# Altium project LoRaBoard.PrjPcb
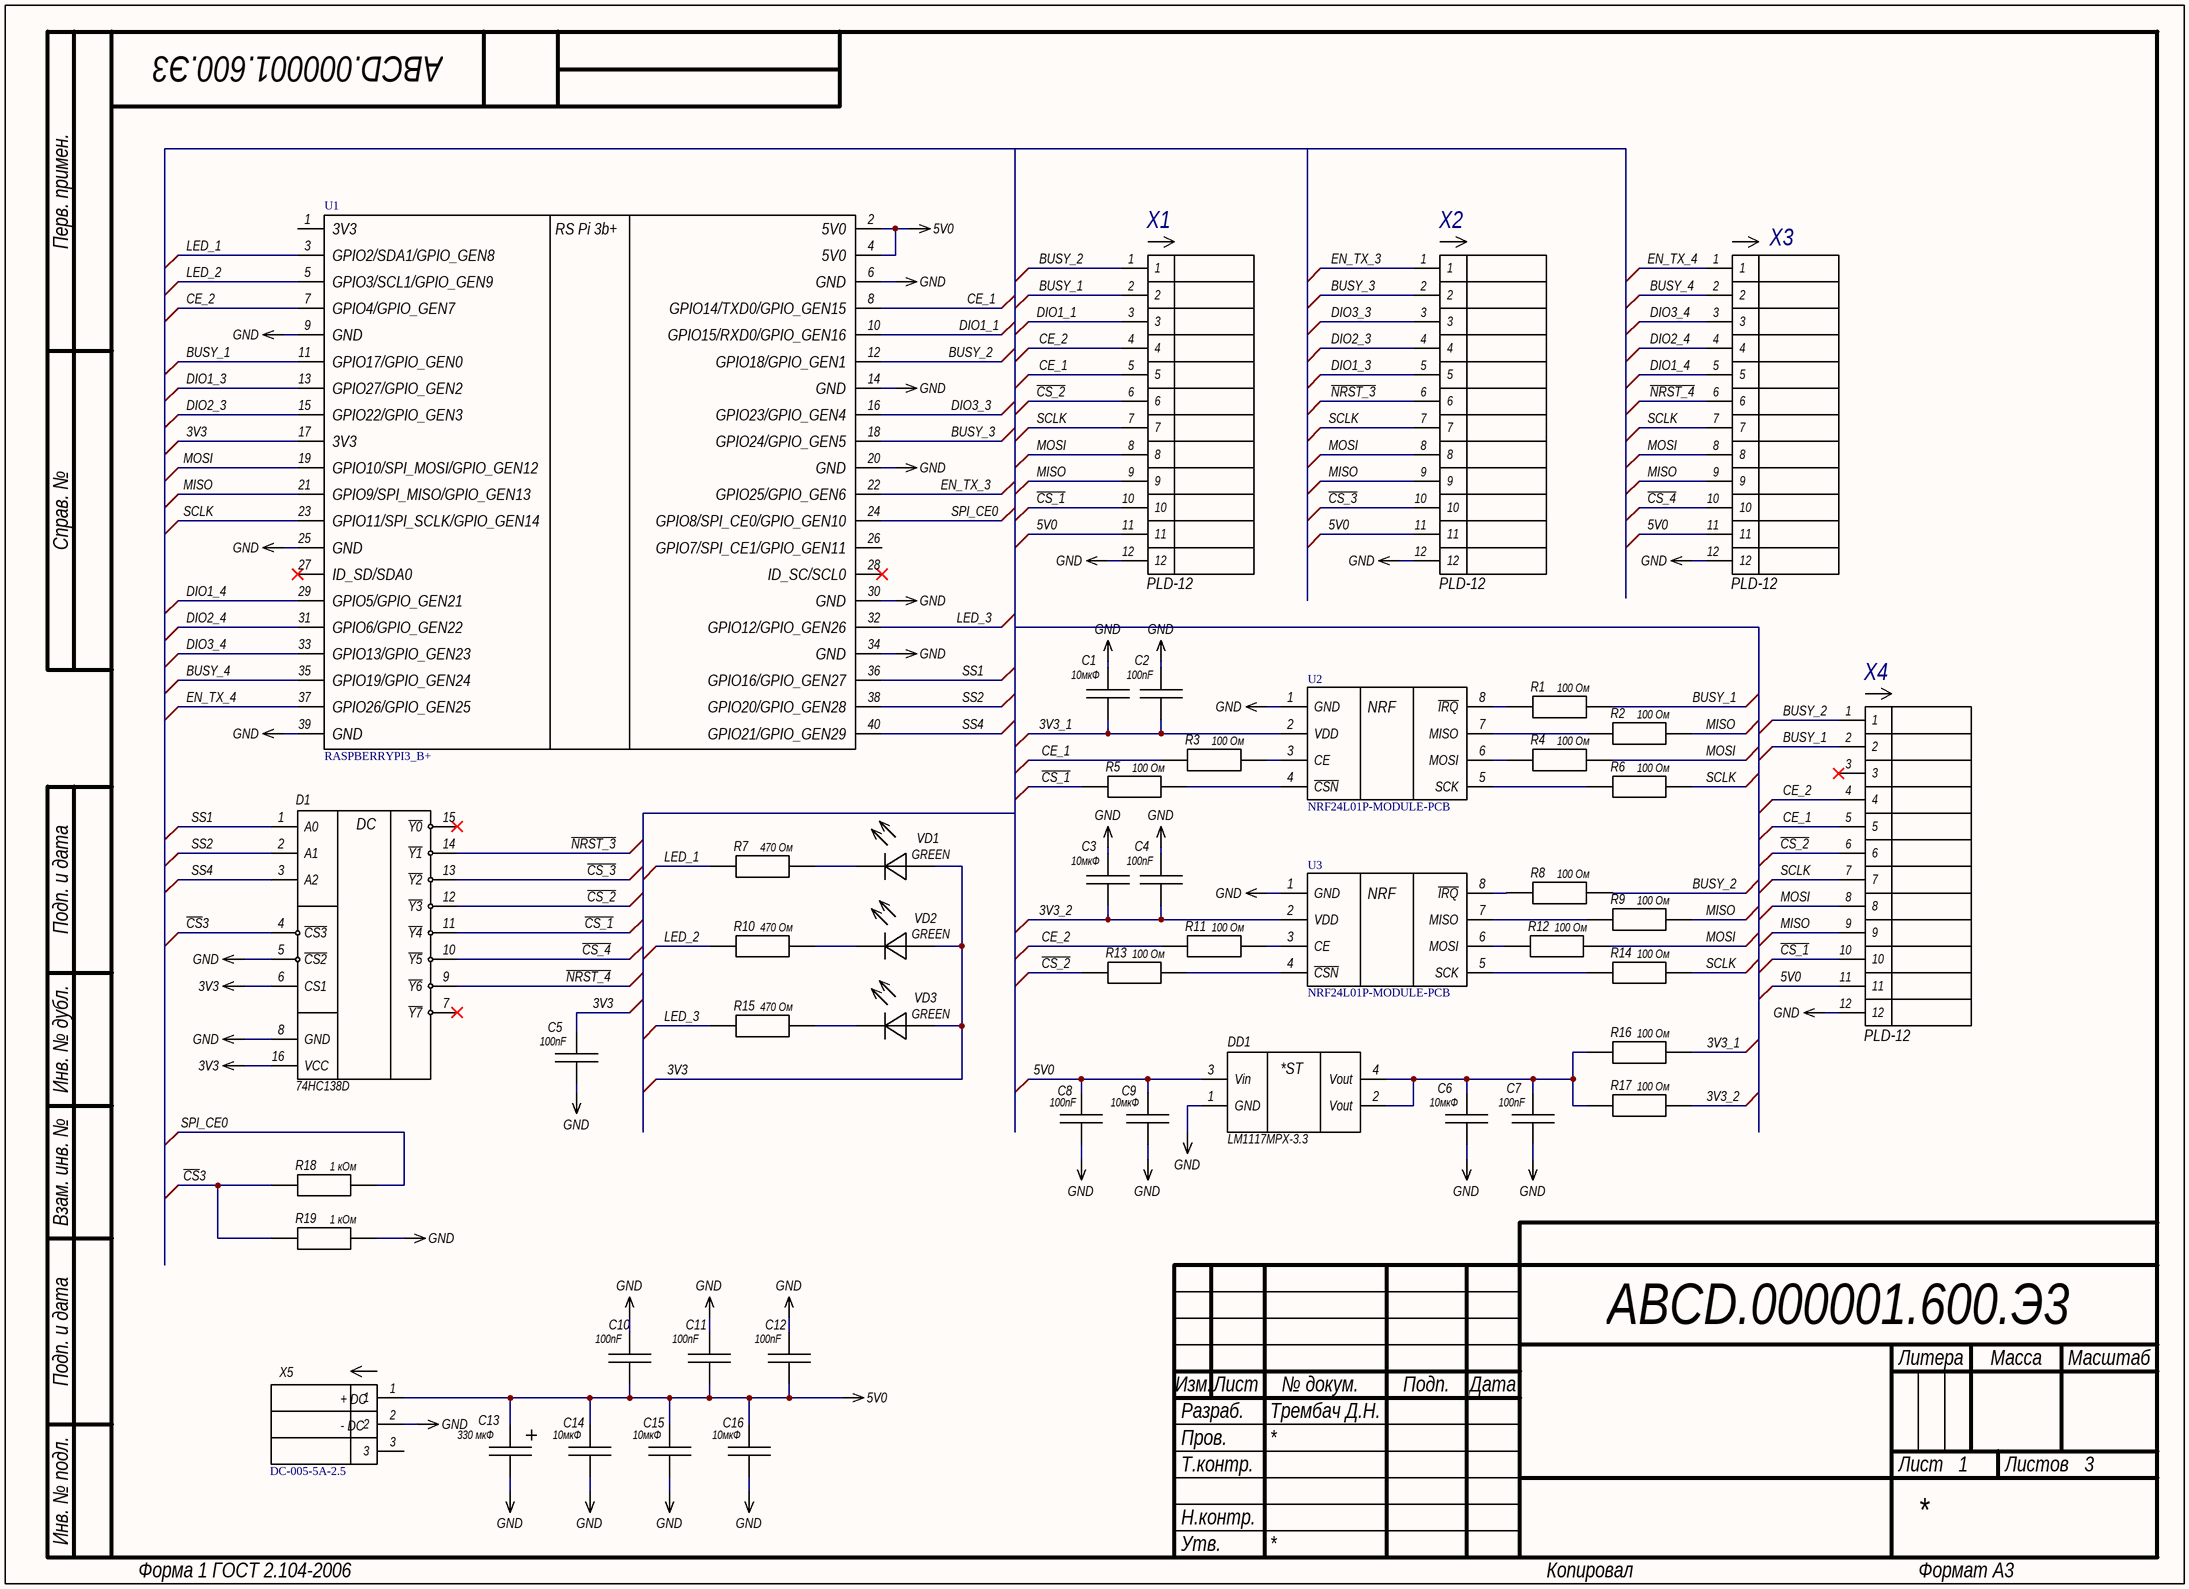
[diagram p0: LoRaBoard_1.SchDoc]
3 sheets, 150 parts. Net scope: global (net labels, ports and power ports of the same name join across sheets).
Board file: LoRaBoard.PcbDoc
Sheets:
  LoRaBoard_1.SchDoc
  LoRaBoard_2.SchDoc
  LoRaBoard_3.SchDoc

## Sheet LoRaBoard_1.SchDoc
size 410 x 297 mm; Author: Трембач Д.Н.; DocumentNumber: ABCD.000001.600.Э3; SheetNumber: 1; SheetTotal: 3

### Parts
C1  10мкФ  [CAP 0805]
C2  100nF  [CAP 0603_1608 RF]
C3  10мкФ  [CAP 0805]
C4  100nF  [CAP 0603_1608 RF]
C5  100nF  [CAP 0603_1608 RF]
C6  10мкФ  [CAP 0805]
C7  100nF  [CAP 0603_1608 RF]
C8  100nF  [CAP 0603_1608 RF]
C9  10мкФ  [CAP 0805]
C10  100nF  [CAP 0603_1608 RF]
C11  100nF  [CAP 0603_1608 RF]
C12  100nF  [CAP 0603_1608 RF]
C13  330 мкФ  [CAP ALSMD ELEC 10.5x10.0 mm]
C14  10мкФ  [CAP 0805]
C15  10мкФ  [CAP 0805]
C16  10мкФ  [CAP 0805]
D1  74HC138D  [SO-16]
DD1  LM1117MPX-3.3  [SOT223]
R1  100 Ом  [RES 0603_1608]
R2  100 Ом  [RES 0603_1608]
R3  100 Ом  [RES 0603_1608]
R4  100 Ом  [RES 0603_1608]
R5  100 Ом  [RES 0603_1608]
R6  100 Ом  [RES 0603_1608]
R7  470 Ом  [RES 0603_1608]
R8  100 Ом  [RES 0603_1608]
R9  100 Ом  [RES 0603_1608]
R10  470 Ом  [RES 0603_1608]
R11  100 Ом  [RES 0603_1608]
R12  100 Ом  [RES 0603_1608]
R13  100 Ом  [RES 0603_1608]
R14  100 Ом  [RES 0603_1608]
R15  470 Ом  [RES 0603_1608]
R16  100 Ом  [RES 0603_1608]
R17  100 Ом  [RES 0603_1608]
R18  1 кОм  [RES 0603_1608]
R19  1 кОм  [RES 0603_1608]
U1  RASPBERRYPI3_B+  [MODULE_RASPBERRYPI3_B+]
U2  NRF24L01P-MODULE-PCB  [NRF24L01P-MODULE]
U3  NRF24L01P-MODULE-PCB  [NRF24L01P-MODULE]
VD1  value GREEN  [LED 0603_1608 GREEN]  (hidden comment: LED SMD GREEN)
VD2  value GREEN  [LED 0603_1608 GREEN]  (hidden comment: LED SMD GREEN)
VD3  value GREEN  [LED 0603_1608 GREEN]  (hidden comment: LED SMD GREEN)
X1  value PLD-12  [PLD_12_elipse]  (hidden comment: PLD-12 (DS1021-2x6))
X2  value PLD-12  [PLD_12_elipse]  (hidden comment: PLD-12 (DS1021-2x6))
X3  value PLD-12  [PLD_12_elipse]  (hidden comment: PLD-12 (DS1021-2x6))
X4  value PLD-12  [PLD_12_elipse]  (hidden comment: PLD-12 (DS1021-2x6))
X5  DC-005-5A-2.5  [DC-005-5A-2.5]

### Nets
3V3: C5.2 D1.6(CS1) D1.16(VCC) U1.17 VD1.1(А) VD2.1(А) VD3.1(А)
5V0: C8.2 C9.2 C10.2 C11.2 C12.2 C13.1 C14.2 C15.2 C16.2 DD1.3(Vin) U1.2 U1.4 X1.11 X2.11 X3.11 X4.11 X5.1
GND: C1.1 C2.1 C3.1 C4.1 C5.1 C6.1 C7.1 C8.1 C9.1 C10.1 C11.1 C12.1 C13.2 C14.1 C15.1 C16.1 D1.5(~{CS2}) D1.8(GND) DD1.1(GND) R19.2 U1.6 U1.9 U1.14 U1.20 U1.25 U1.30 U1.34 U1.39 U2.1(GND) U3.1(GND) X1.12 X2.12 X3.12 X4.12 X5.2
3V3_1: C1.2 C2.2 R16.2 U2.2(VDD)
3V3_2: C3.2 C4.2 R17.2 U3.2(VDD)
~{CS}3: D1.4(~{CS3}) R18.1 R19.1
BUSY_1: R1.2 U1.11 X1.2 X4.2
BUSY_2: R8.2 U1.12 X1.1 X4.1
BUSY_3: U1.18 X2.2
BUSY_4: U1.35 X3.2
~{CS_1}: D1.11(~{Y4}) R5.1 X1.10 X4.10
~{CS_2}: D1.12(~{Y3}) R13.1 X1.6 X4.6
~{CS_3}: D1.13(~{Y2}) X2.10
~{CS_4}: D1.10(~{Y5}) X3.10
CE_1: R3.1 U1.8 X1.5 X4.5
CE_2: R11.1 U1.7 X1.4 X4.4
DIO1_1: U1.10 X1.3
DIO1_3: U1.13 X2.5
DIO1_4: U1.29 X3.5
DIO2_3: U1.15 X2.4
DIO2_4: U1.31 X3.4
DIO3_3: U1.16 X2.3
DIO3_4: U1.33 X3.3
EN_TX_3: U1.22 X2.1
EN_TX_4: U1.37 X3.1
LED_1: R7.1 U1.3
LED_2: R10.1 U1.5
LED_3: R15.1 U1.32
MISO: R2.2 R9.2 U1.21 X1.9 X2.9 X3.9 X4.9
MOSI: R4.2 R12.2 U1.19 X1.8 X2.8 X3.8 X4.8
~{NRST_3}: D1.14(~{Y1}) X2.6
~{NRST_4}: D1.9(~{Y6}) X3.6
SCLK: R6.2 R14.2 U1.23 X1.7 X2.7 X3.7 X4.7
SPI_CE0: R18.2 U1.24
SS1: D1.1(A0) U1.36
SS2: D1.2(A1) U1.38
SS4: D1.3(A2) U1.40
NetC6_2: C6.2 C7.2 DD1.2(Vout) DD1.4(Vout) R16.1 R17.1
NetR1_1: R1.1 U2.8(~{IRQ})
NetR2_1: R2.1 U2.7(MISO)
NetR3_2: R3.2 U2.3(CE)
NetR4_1: R4.1 U2.6(MOSI)
NetR5_2: R5.2 U2.4(~{CSN})
NetR6_1: R6.1 U2.5(SCK)
NetR7_2: R7.2 VD1.2(К)
NetR8_1: R8.1 U3.8(~{IRQ})
NetR9_1: R9.1 U3.7(MISO)
NetR10_2: R10.2 VD2.2(К)
NetR11_2: R11.2 U3.3(CE)
NetR12_1: R12.1 U3.6(MOSI)
NetR13_2: R13.2 U3.4(~{CSN})
NetR14_1: R14.1 U3.5(SCK)
NetR15_2: R15.2 VD3.2(К)

Not connected (* = marked no-connect by the designer): D1 7(~{Y7})* 15(~{Y0})*; U1 1 26 27* 28*; X4 3*; X5 3

### Notes on the sheet
- Перв. примен.
- Справ. №
- Подп. и дата
- Инв. № дубл.
- Взам. инв. №
- Разраб.
- Изм.
- Лист
- № докум.
- Подп.
- Дата
- Литера
- Масса
- Масштаб
- Пров.
- Т.контр.
- Листов
- Инв. № подл.
- Н.контр.
- Утв.
- Форма 1 ГОСТ 2.104-2006
- Копировал
- Формат А3
- (in symbol 74HC138D) DC
- (in symbol DC-005-5A-2.5) + DC; - DC
- (in symbol LM1117MPX-3.3) *ST
- (in symbol NRF24L01P-MODULE-PCB) NRF
- (in symbol RASPBERRYPI3_B+) 3V3; RS Pi 3b+; 5V0; GPIO2/SDA1/GPIO_GEN8; GPIO3/SCL1/GPIO_GEN9; GND; GPIO4/GPIO_GEN7; GPIO14/TXD0/GPIO_GEN15; GPIO15/RXD0/GPIO_GEN16; GPIO17/GPIO_GEN0; GPIO18/GPIO_GEN1; GPIO27/GPIO_GEN2; GPIO22/GPIO_GEN3; GPIO23/GPIO_GEN4; GPIO24/GPIO_GEN5; GPIO10/SPI_MOSI/GPIO_GEN12; GPIO9/SPI_MISO/GPIO_GEN13; GPIO25/GPIO_GEN6; GPIO11/SPI_SCLK/GPIO_GEN14; GPIO8/SPI_CE0/GPIO_GEN10; GPIO7/SPI_CE1/GPIO_GEN11; ID_SD/SDA0; ID_SC/SCL0; GPIO5/GPIO_GEN21; GPIO6/GPIO_GEN22; GPIO12/GPIO_GEN26; GPIO13/GPIO_GEN23; GPIO19/GPIO_GEN24; GPIO16/GPIO_GEN27; GPIO26/GPIO_GEN25; GPIO20/GPIO_GEN28; GPIO21/GPIO_GEN29

### Library data of the parts
C1 C3 C6 C9 C14-C16 = Capacitor: 10мкФ X5R 16В 10% 0805, CC0805KKX5R7BB106; Vendor Code: *; Value: 10мкФ; Part Number: CC0805KKX5R7BB106
C2 C4 C5 C7 C8 C10-C12 = Capacitor: CC0603JPX7R9BB104, 50V 100nF X7R 5% 0603; Vendor Code: *; Value: 100nF; Part Number: CC0603JPX7R9BB104
C13 = CAP ALSMD ELEC: ECAP SMD, 330 мкФ, 35 В, 105°C, 20% 10x10.5мм, JCK1V331M100105; Vendor Code: *; Value: 330 мкФ; Part Number: ECAP SMD, 330 мкФ, 35 В, 105°C, 20% 10x10.5мм, JCK1V331M100105
D1 = 74HC138D: 3-to-8 line decoder/demultiplexer; Vendor Code: *; Value: 74HC138D
DD1 = LM1117MPX-3.3: 800mA Low-Dropout Linear Regulator; Vendor Code: *; Value: LM1117MPX-3.3
R1-R6 R8 R9 R11-R14 R16 R17 = Resistor: 0.1Вт 0603 100 Ом, 5%, RC0603JR-07100RL; Type: Резистор; Vendor Code: *; Value: 100 Ом; Part Number: RC0603JR-07100RL
R7 R10 R15 = Resistor: 0.1Вт 0603 100 Ом, 5%, RC0603JR-07470RL; Type: Резистор; Vendor Code: *; Value: 470 Ом; Part Number: RC0603JR-07470RL
R18 R19 = Resistor: 0.1Вт 0603 1 кОм, 5%, RC0603JR-071KL; Type: Резистор; Vendor Code: *; Value: 1 кОм; Part Number: RC0603JR-071KL
U1 = RASPBERRYPI3_B+: 1.4GHz 64-bit quad-core processor, dual-band wireless LAN, Bluetooth 4.2/BLE, faster Ethernet, and Power-over-Ethernet support (with separate PoE HAT); MF: Raspberry Pi Foundation (NF); Price: None; Availability: Unavailable; Package: None; SnapEDA_Link: https://www.snapeda.com/parts/RASPBERRYPI4%204GB/Raspberry%20Pi/view-part/3832294/?ref=snap; Value: *; MP: RASPBERRYPI3_B+; Vendor Code: *
U2 U3 = NRF24L01P-MODULE-PCB: - Transceiver For Use With nRF24L01+; MF: Nordic Semiconductor; Package: None; MP: NRF24L01P-MODULE-PCB; Value: *; Availability: Bad; Price: None; SnapEDA_Link: https://www.snapeda.com/parts/NRF24L01P-MODULE-PCB/Nordic%20Semiconductor%20ASA/view-part/230534/?ref=snap; Mouser-Purchase-URL: https://snapeda.com/shop?store=Mouser&id=230534
X1-X4 = PLD-12: 2.54mm PIN Header 2X6P Straight Type H=2.5mm Full Gold Flash Plating.; Published: 07.03.2013; Publisher: Andrew Danich; Type: Вилка
X5 = DC-005-5A-2.5: DC Power Receptacle Jack, Through Hole, Right Angle; MP: DC-005-5A-2.5
VD1-VD3 = LED SMD GREEN: Vendor Code: *

## Sheet LoRaBoard_2.SchDoc
size 410 x 297 mm; DocumentNumber: ABCD.000001.600.Э3; SheetNumber: 2; SheetTotal: 3; _DecimalNumber: ABCD.000001.600.Э3; _Sheet: 2; PageSetup: Record=PageOptions|CenterHorizontal=False|CenterVertical=False|PrintScale=1.00|XCorrection=1.00|YCorrection=1.00|PrintKind=0|BorderSize=5000000|LeftOffset=0|BottomOffset=0|Orientation=2|PaperLength=1000|PaperWidth=1000|Scale=100|PaperSource=7|PrintQuality=-3|MediaType=1|DitherType=10|PrintScaleMode=0|PaperKind=A3|PaperIndex=8
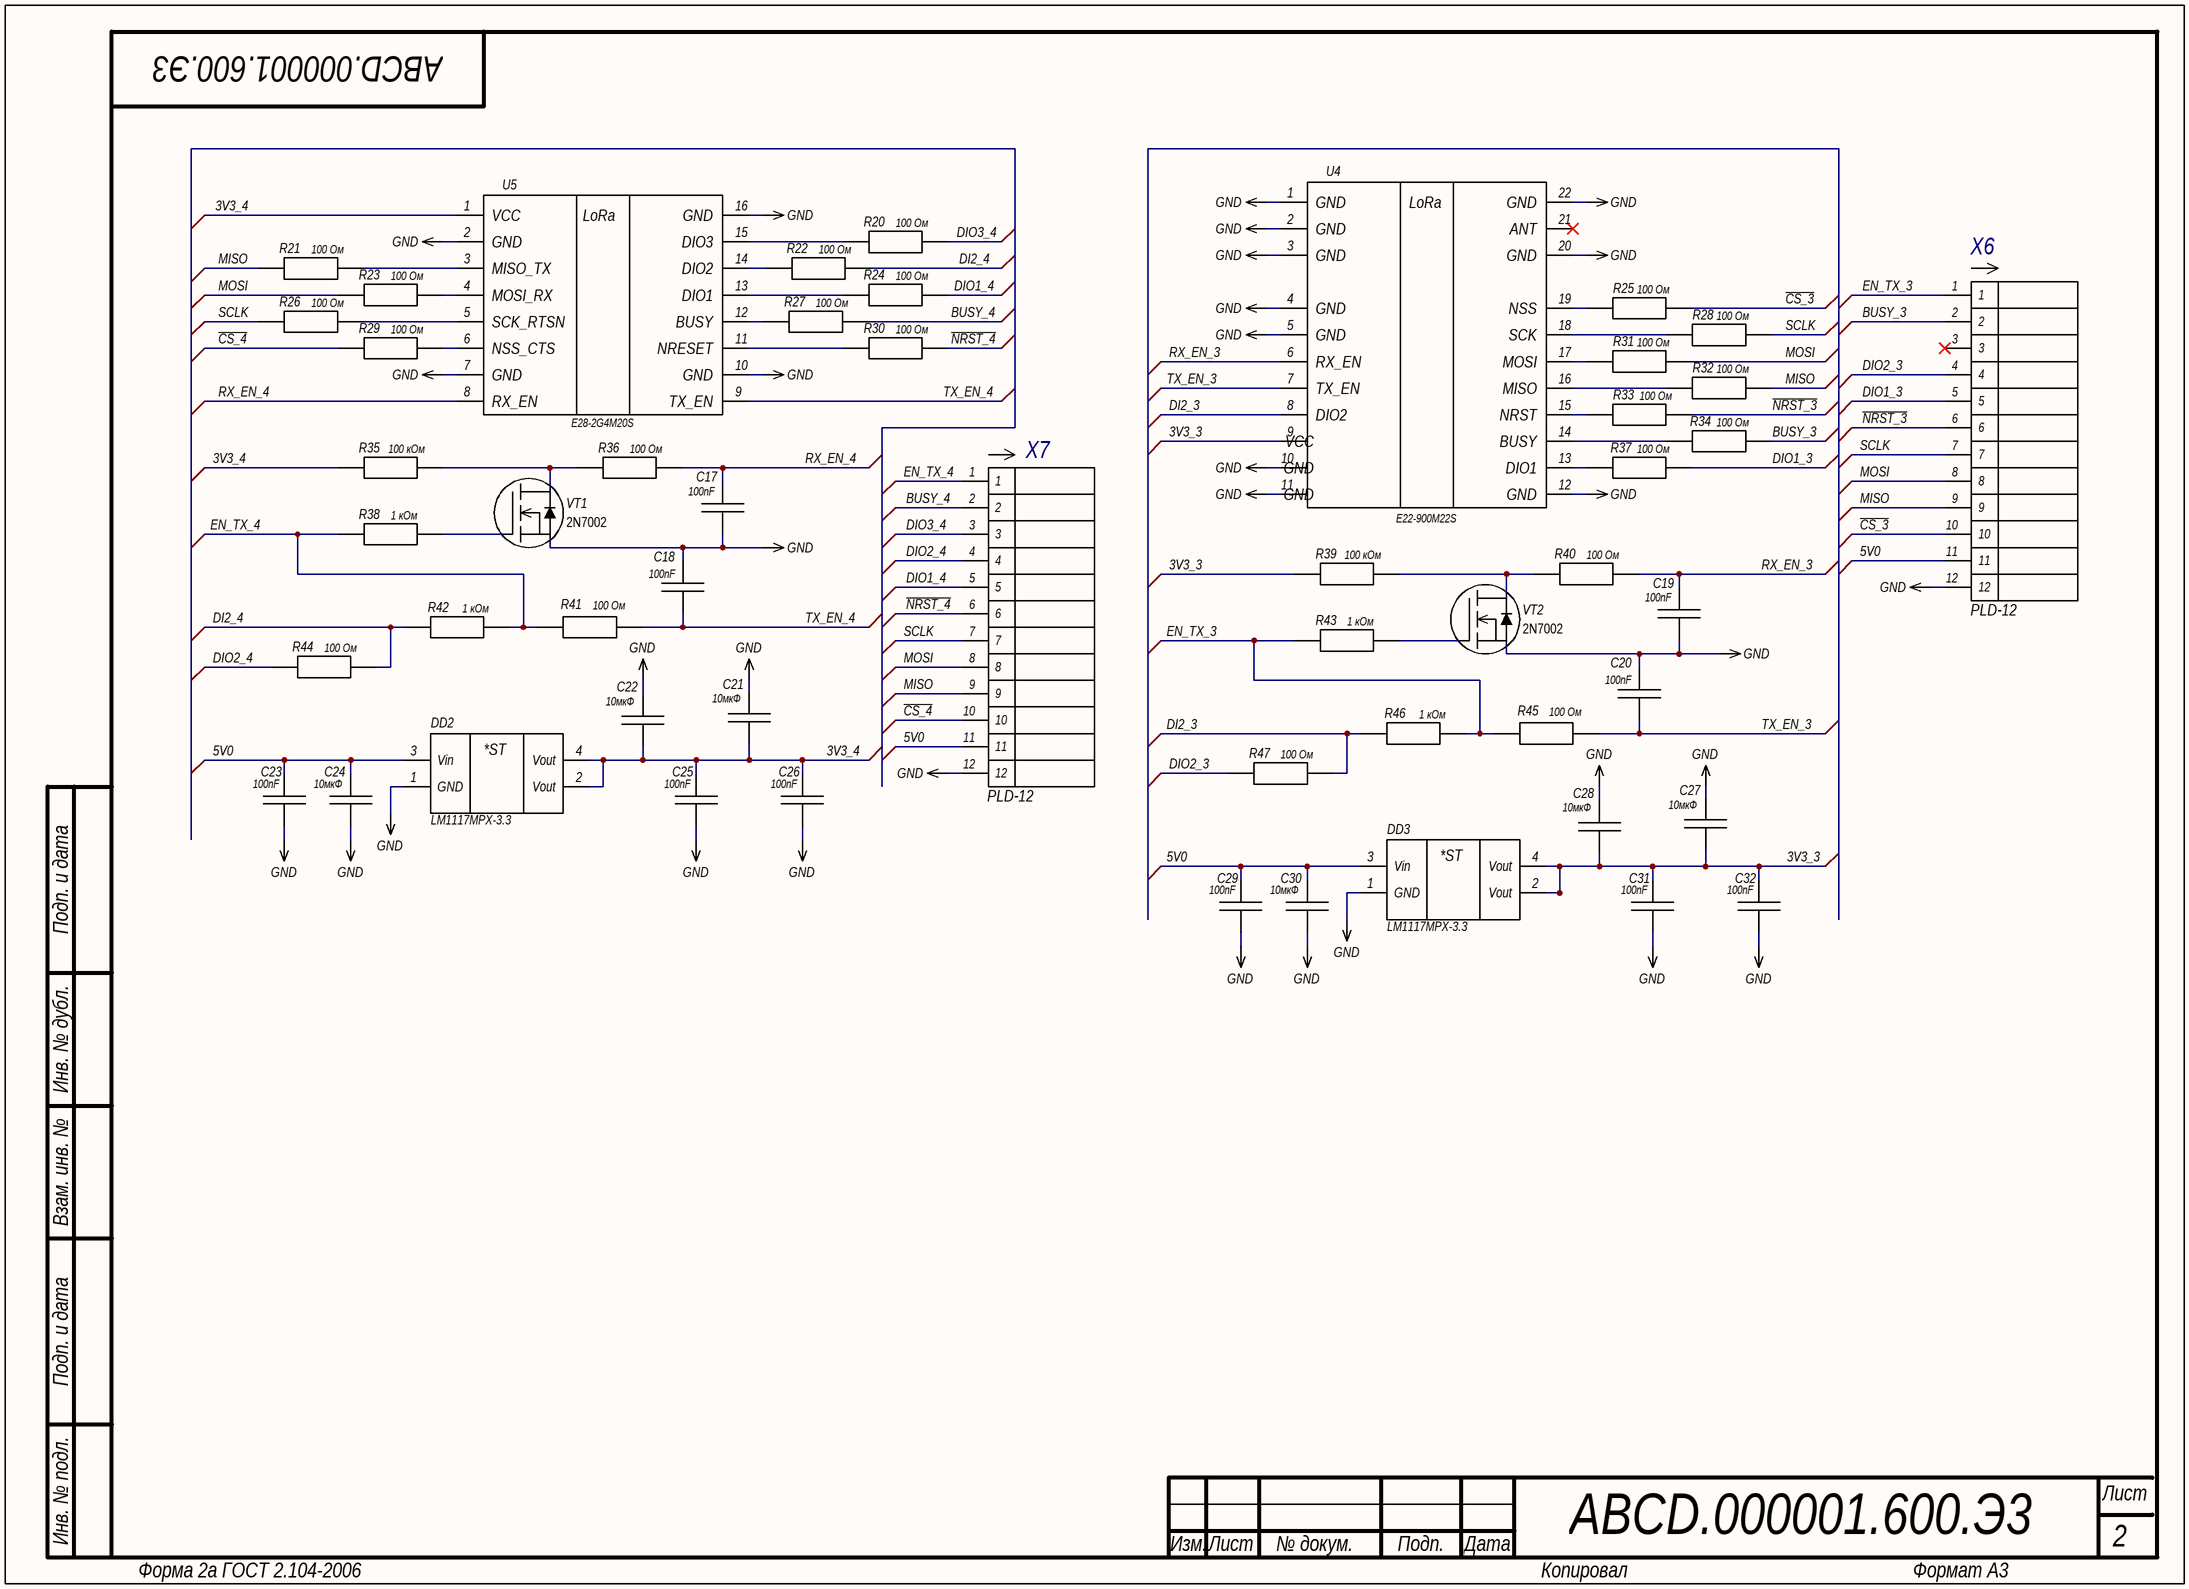
[diagram p1: LoRaBoard_2.SchDoc]

### Parts
C17  100nF  [CAP 0603_1608 RF]
C18  100nF  [CAP 0603_1608 RF]
C19  100nF  [CAP 0603_1608 RF]
C20  100nF  [CAP 0603_1608 RF]
C21  10мкФ  [CAP 0805]
C22  10мкФ  [CAP 0805]
C23  100nF  [CAP 0603_1608 RF]
C24  10мкФ  [CAP 0805]
C25  100nF  [CAP 0603_1608 RF]
C26  100nF  [CAP 0603_1608 RF]
C27  10мкФ  [CAP 0805]
C28  10мкФ  [CAP 0805]
C29  100nF  [CAP 0603_1608 RF]
C30  10мкФ  [CAP 0805]
C31  100nF  [CAP 0603_1608 RF]
C32  100nF  [CAP 0603_1608 RF]
DD2  LM1117MPX-3.3  [SOT223]
DD3  LM1117MPX-3.3  [SOT223]
R20  100 Ом  [RES 0603_1608]
R21  100 Ом  [RES 0603_1608]
R22  100 Ом  [RES 0603_1608]
R23  100 Ом  [RES 0603_1608]
R24  100 Ом  [RES 0603_1608]
R25  100 Ом  [RES 0603_1608]
R26  100 Ом  [RES 0603_1608]
R27  100 Ом  [RES 0603_1608]
R28  100 Ом  [RES 0603_1608]
R29  100 Ом  [RES 0603_1608]
R30  100 Ом  [RES 0603_1608]
R31  100 Ом  [RES 0603_1608]
R32  100 Ом  [RES 0603_1608]
R33  100 Ом  [RES 0603_1608]
R34  100 Ом  [RES 0603_1608]
R35  100 кОм  [RES 0603_1608]
R36  100 Ом  [RES 0603_1608]
R37  100 Ом  [RES 0603_1608]
R38  1 кОм  [RES 0603_1608]
R39  100 кОм  [RES 0603_1608]
R40  100 Ом  [RES 0603_1608]
R41  100 Ом  [RES 0603_1608]
R42  1 кОм  [RES 0603_1608]
R43  1 кОм  [RES 0603_1608]
R44  100 Ом  [RES 0603_1608]
R45  100 Ом  [RES 0603_1608]
R46  1 кОм  [RES 0603_1608]
R47  100 Ом  [RES 0603_1608]
U4  E22-900M22S  [E22 900M22S]
U5  E28-2G4M20S  [E28 2G4M20S]
VT1  2N7002  [SOT23-3]
VT2  2N7002  [SOT23-3]
X6  value PLD-12  [PLD_12_elipse]  (hidden comment: PLD-12 (DS1021-2x6))
X7  value PLD-12  [PLD_12_elipse]  (hidden comment: PLD-12 (DS1021-2x6))

### Nets
5V0: C23.2 C24.2 C29.2 C30.2 DD2.3(Vin) DD3.3(Vin) X6.11 X7.11
GND: C17.1 C18.2 C19.1 C20.2 C21.1 C22.1 C23.1 C24.1 C25.1 C26.1 C27.1 C28.1 C29.1 C30.1 C31.1 C32.1 DD2.1(GND) DD3.1(GND) U4.1 U4.2 U4.3 U4.4 U4.5 U4.10 U4.11 U4.12 U4.20 U4.22 U5.2 U5.7 U5.10 U5.16 VT1.2(S) VT2.2(S) X6.12 X7.12
3V3_3: C27.2 C28.2 C31.2 C32.2 DD3.2(Vout) DD3.4(Vout) R39.1 U4.9
3V3_4: C21.2 C22.2 C25.2 C26.2 DD2.2(Vout) DD2.4(Vout) R35.1 U5.1
BUSY_3: R34.2 X6.2
BUSY_4: R27.2 X7.2
~{CS_3}: R25.2 X6.10
~{CS_4}: R29.1 X7.10
DI2_3: R46.1 R47.2 U4.8
DI2_4: R22.2 R42.1 R44.2
DIO1_3: R37.2 X6.5
DIO1_4: R24.2 X7.5
DIO2_3: R47.1 X6.4
DIO2_4: R44.1 X7.4
DIO3_4: R20.2 X7.3
EN_TX_3: R43.1 R45.1 R46.2 X6.1
EN_TX_4: R38.1 R41.1 R42.2 X7.1
MISO: R21.1 R32.2 X6.9 X7.9
MOSI: R23.1 R31.2 X6.8 X7.8
~{NRST_3}: R33.2 X6.6
~{NRST_4}: R30.2 X7.6
RX_EN_3: C19.2 R40.2 U4.6
RX_EN_4: C17.2 R36.2 U5.8
SCLK: R26.1 R28.2 X6.7 X7.7
TX_EN_3: C20.1 R45.2 U4.7
TX_EN_4: C18.1 R41.2 U5.9
NetR20_1: R20.1 U5.15
NetR21_2: R21.2 U5.3
NetR22_1: R22.1 U5.14
NetR23_2: R23.2 U5.4
NetR24_1: R24.1 U5.13
NetR25_1: R25.1 U4.19
NetR26_2: R26.2 U5.5
NetR27_1: R27.1 U5.12
NetR28_1: R28.1 U4.18
NetR29_2: R29.2 U5.6
NetR30_1: R30.1 U5.11
NetR31_1: R31.1 U4.17
NetR32_1: R32.1 U4.16
NetR33_1: R33.1 U4.15
NetR34_1: R34.1 U4.14
NetR35_2: R35.2 R36.1 VT1.3(D)
NetR37_1: R37.1 U4.13
NetR38_2: R38.2 VT1.1(G)
NetR39_2: R39.2 R40.1 VT2.3(D)
NetR43_2: R43.2 VT2.1(G)

Not connected (* = marked no-connect by the designer): U4 21*; X6 3*

### Notes on the sheet
- Подп. и дата
- Инв. № дубл.
- Взам. инв. №
- Инв. № подл.
- Изм.
- Лист
- № докум.
- Подп.
- Дата
- Форма 2а ГОСТ 2.104-2006
- Копировал
- Формат А3
- (in symbol E22-900M22S) GND; LoRa; ANT; NSS; SCK; RX_EN; MOSI; TX_EN; MISO; DIO2; NRST; VCC; BUSY; DIO1
- (in symbol E28-2G4M20S) VCC; LoRa; GND; DIO3; MISO_TX; DIO2; MOSI_RX; DIO1; SCK_RTSN; BUSY; NSS_CTS; NRESET; RX_EN; TX_EN
- (in symbol LM1117MPX-3.3) *ST

### Library data of the parts
C17-C20 C23 C25 C26 C29 C31 C32 = Capacitor: CC0603JPX7R9BB104, 50V 100nF X7R 5% 0603; Vendor Code: *; Value: 100nF; Part Number: CC0603JPX7R9BB104
C21 C22 C24 C27 C28 C30 = Capacitor: as C1 on sheet LoRaBoard_1; Vendor Code: *; Value: 10мкФ; Part Number: CC0805KKX5R7BB106
DD2 DD3 = LM1117MPX-3.3: 800mA Low-Dropout Linear Regulator; Vendor Code: *; Value: LM1117MPX-3.3
R20-R34 R36 R37 R40 R41 R44 R45 R47 = Resistor: 0.1Вт 0603 100 Ом, 5%, RC0603JR-07100RL; Type: Резистор; Vendor Code: *; Value: 100 Ом; Part Number: RC0603JR-07100RL
R35 R39 = Resistor: 0.1Вт 0603 100 кОм, 5%, RC0603JR-071KL; Part Number: RC0603JR-07100KL; Type: Резистор; Vendor Code: *; Value: 100 кОм
R38 R42 R43 R46 = Resistor: 0.1Вт 0603 1 кОм, 5%, RC0603JR-071KL; Type: Резистор; Vendor Code: *; Value: 1 кОм; Part Number: RC0603JR-071KL
U4 = E22-900M22S: E22-900M22S Ebyte -147dBm 22.3dBm 7km SPI SMD,14x20mm LoRa Modules; Pitch: 1.27; Part Number: E22-900M22S; Value: E22-900M22S; Package: 14x20mm; Temperature Range: -40…+85 °C; Manufacturer: EBYTE; Number of Rows: 2; Number of Pins: 22
U5 = E28-2G4M20S: E28-2G4M20S Ebyte  -132dBm 21dBm 6km SPI SMD,15x26.5mm LoRa Modules; Pitch: 1.27; Part Number: E28-2G4M20S; Value: E28-2G4M20S; Package: 15x26.5mm; Temperature Range: -40…+85 °C; Manufacturer: EBYTE; Number of Rows: 2; Number of Pins: 16
VT1 VT2 = 2N7002ET1G: MOSFET-N-60V-0.3A; Manufacturer: ON Semiconductor; Number of Channels: 1; Polarity: N-Channel; Drain Source Voltage: 60V; Drain Current: 0.3A; On Drain Source Resistance: 0.2Ohm; Gate Source Voltage: ±20V; Power Disspansion: 0.5W; Part Number: 2N7002ET1G; Value: 2N7002; Package: SOT-23; Temperature Range: -55…+150°C
X6 X7 = PLD-12: as X1 on sheet LoRaBoard_1; Published: 07.03.2013; Publisher: Andrew Danich; Type: Вилка

## Sheet LoRaBoard_3.SchDoc
size 410 x 297 mm; DocumentNumber: ABCD.000001.600.Э3; SheetNumber: 3; SheetTotal: 3; _DecimalNumber: ABCD.000001.600.Э3; _Sheet: 2; PageSetup: Record=PageOptions|CenterHorizontal=False|CenterVertical=False|PrintScale=1.00|XCorrection=1.00|YCorrection=1.00|PrintKind=0|BorderSize=5000000|LeftOffset=0|BottomOffset=0|Orientation=2|PaperLength=1000|PaperWidth=1000|Scale=100|PaperSource=7|PrintQuality=-3|MediaType=1|DitherType=10|PrintScaleMode=0|PaperKind=A3|PaperIndex=8
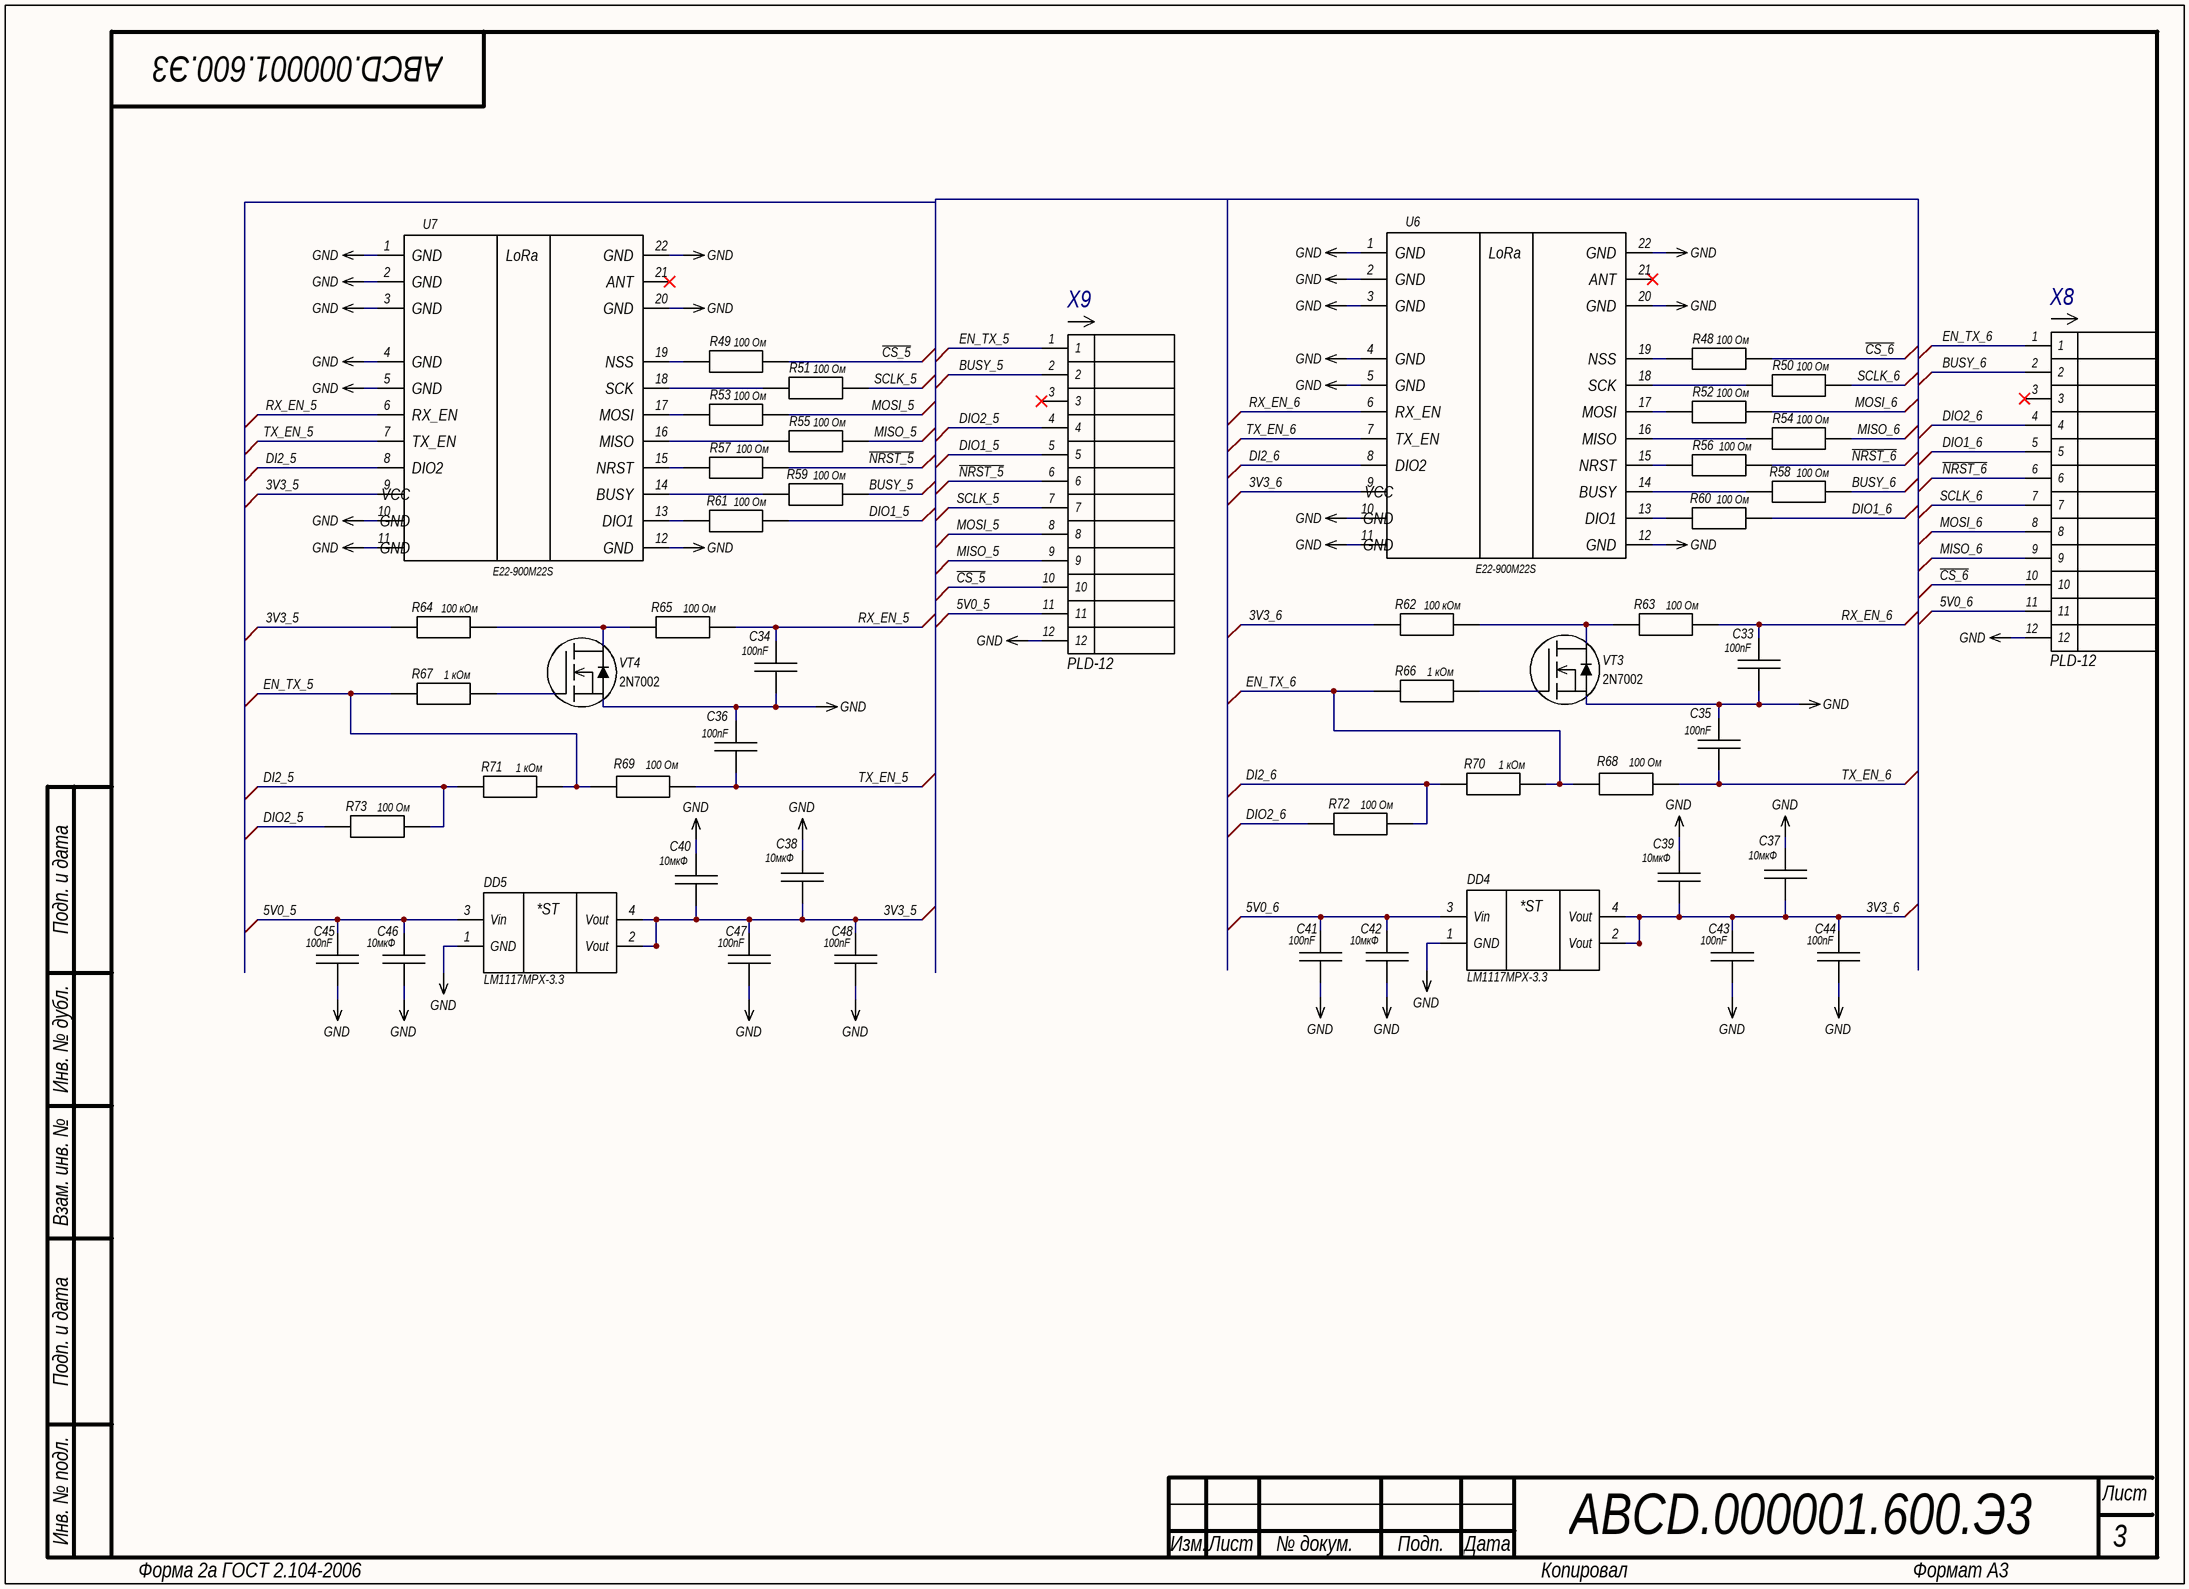
[diagram p2: LoRaBoard_3.SchDoc]

### Parts
C33  100nF  [CAP 0603_1608 RF]
C34  100nF  [CAP 0603_1608 RF]
C35  100nF  [CAP 0603_1608 RF]
C36  100nF  [CAP 0603_1608 RF]
C37  10мкФ  [CAP 0805]
C38  10мкФ  [CAP 0805]
C39  10мкФ  [CAP 0805]
C40  10мкФ  [CAP 0805]
C41  100nF  [CAP 0603_1608 RF]
C42  10мкФ  [CAP 0805]
C43  100nF  [CAP 0603_1608 RF]
C44  100nF  [CAP 0603_1608 RF]
C45  100nF  [CAP 0603_1608 RF]
C46  10мкФ  [CAP 0805]
C47  100nF  [CAP 0603_1608 RF]
C48  100nF  [CAP 0603_1608 RF]
DD4  LM1117MPX-3.3  [SOT223]
DD5  LM1117MPX-3.3  [SOT223]
R48  100 Ом  [RES 0603_1608]
R49  100 Ом  [RES 0603_1608]
R50  100 Ом  [RES 0603_1608]
R51  100 Ом  [RES 0603_1608]
R52  100 Ом  [RES 0603_1608]
R53  100 Ом  [RES 0603_1608]
R54  100 Ом  [RES 0603_1608]
R55  100 Ом  [RES 0603_1608]
R56  100 Ом  [RES 0603_1608]
R57  100 Ом  [RES 0603_1608]
R58  100 Ом  [RES 0603_1608]
R59  100 Ом  [RES 0603_1608]
R60  100 Ом  [RES 0603_1608]
R61  100 Ом  [RES 0603_1608]
R62  100 кОм  [RES 0603_1608]
R63  100 Ом  [RES 0603_1608]
R64  100 кОм  [RES 0603_1608]
R65  100 Ом  [RES 0603_1608]
R66  1 кОм  [RES 0603_1608]
R67  1 кОм  [RES 0603_1608]
R68  100 Ом  [RES 0603_1608]
R69  100 Ом  [RES 0603_1608]
R70  1 кОм  [RES 0603_1608]
R71  1 кОм  [RES 0603_1608]
R72  100 Ом  [RES 0603_1608]
R73  100 Ом  [RES 0603_1608]
U6  E22-900M22S  [E22 900M22S]
U7  E22-900M22S  [E22 900M22S]
VT3  2N7002  [SOT23-3]
VT4  2N7002  [SOT23-3]
X8  value PLD-12  [PLD_12_elipse]  (hidden comment: PLD-12 (DS1021-2x6))
X9  value PLD-12  [PLD_12_elipse]  (hidden comment: PLD-12 (DS1021-2x6))

### Nets
GND: C33.1 C34.1 C35.2 C36.2 C37.1 C38.1 C39.1 C40.1 C41.1 C42.1 C43.1 C44.1 C45.1 C46.1 C47.1 C48.1 DD4.1(GND) DD5.1(GND) U6.1 U6.2 U6.3 U6.4 U6.5 U6.10 U6.11 U6.12 U6.20 U6.22 U7.1 U7.2 U7.3 U7.4 U7.5 U7.10 U7.11 U7.12 U7.20 U7.22 VT3.2(S) VT4.2(S) X8.12 X9.12
3V3_5: C38.2 C40.2 C47.2 C48.2 DD5.2(Vout) DD5.4(Vout) R64.1 U7.9
3V3_6: C37.2 C39.2 C43.2 C44.2 DD4.2(Vout) DD4.4(Vout) R62.1 U6.9
5V0_5: C45.2 C46.2 DD5.3(Vin) X9.11
5V0_6: C41.2 C42.2 DD4.3(Vin) X8.11
BUSY_5: R59.2 X9.2
BUSY_6: R58.2 X8.2
~{CS_5}: R49.2 X9.10
~{CS_6}: R48.2 X8.10
DI2_5: R71.1 R73.2 U7.8
DI2_6: R70.1 R72.2 U6.8
DIO1_5: R61.2 X9.5
DIO1_6: R60.2 X8.5
DIO2_5: R73.1 X9.4
DIO2_6: R72.1 X8.4
EN_TX_5: R67.1 R69.1 R71.2 X9.1
EN_TX_6: R66.1 R68.1 R70.2 X8.1
MISO_5: R55.2 X9.9
MISO_6: R54.2 X8.9
MOSI_5: R53.2 X9.8
MOSI_6: R52.2 X8.8
~{NRST_5}: R57.2 X9.6
~{NRST_6}: R56.2 X8.6
RX_EN_5: C34.2 R65.2 U7.6
RX_EN_6: C33.2 R63.2 U6.6
SCLK_5: R51.2 X9.7
SCLK_6: R50.2 X8.7
TX_EN_5: C36.1 R69.2 U7.7
TX_EN_6: C35.1 R68.2 U6.7
NetR48_1: R48.1 U6.19
NetR49_1: R49.1 U7.19
NetR50_1: R50.1 U6.18
NetR51_1: R51.1 U7.18
NetR52_1: R52.1 U6.17
NetR53_1: R53.1 U7.17
NetR54_1: R54.1 U6.16
NetR55_1: R55.1 U7.16
NetR56_1: R56.1 U6.15
NetR57_1: R57.1 U7.15
NetR58_1: R58.1 U6.14
NetR59_1: R59.1 U7.14
NetR60_1: R60.1 U6.13
NetR61_1: R61.1 U7.13
NetR62_2: R62.2 R63.1 VT3.3(D)
NetR64_2: R64.2 R65.1 VT4.3(D)
NetR66_2: R66.2 VT3.1(G)
NetR67_2: R67.2 VT4.1(G)

Not connected (* = marked no-connect by the designer): U6 21*; U7 21*; X8 3*; X9 3*

### Notes on the sheet
- Подп. и дата
- Инв. № дубл.
- Взам. инв. №
- Инв. № подл.
- Изм.
- Лист
- № докум.
- Подп.
- Дата
- Форма 2а ГОСТ 2.104-2006
- Копировал
- Формат А3
- (in symbol E22-900M22S) GND; LoRa; ANT; NSS; SCK; RX_EN; MOSI; TX_EN; MISO; DIO2; NRST; VCC; BUSY; DIO1
- (in symbol LM1117MPX-3.3) *ST

### Library data of the parts
C33-C36 C41 C43-C45 C47 C48 = Capacitor: CC0603JPX7R9BB104, 50V 100nF X7R 5% 0603; Vendor Code: *; Value: 100nF; Part Number: CC0603JPX7R9BB104
C37-C40 C42 C46 = Capacitor: as C1 on sheet LoRaBoard_1; Vendor Code: *; Value: 10мкФ; Part Number: CC0805KKX5R7BB106
DD4 DD5 = LM1117MPX-3.3: 800mA Low-Dropout Linear Regulator; Vendor Code: *; Value: LM1117MPX-3.3
R48-R61 R63 R65 R68 R69 R72 R73 = Resistor: 0.1Вт 0603 100 Ом, 5%, RC0603JR-07100RL; Type: Резистор; Vendor Code: *; Value: 100 Ом; Part Number: RC0603JR-07100RL
R62 R64 = Resistor: as R35 on sheet LoRaBoard_2; Type: Резистор; Vendor Code: *; Value: 100 кОм
R66 R67 R70 R71 = Resistor: 0.1Вт 0603 1 кОм, 5%, RC0603JR-071KL; Type: Резистор; Vendor Code: *; Value: 1 кОм; Part Number: RC0603JR-071KL
U6 U7 = E22-900M22S: as U4 on sheet LoRaBoard_2; Part Number: E22-900M22S; Value: E22-900M22S; Package: 14x20mm; Temperature Range: -40…+85 °C; Manufacturer: EBYTE; Number of Rows: 2; Number of Pins: 22
VT3 VT4 = 2N7002ET1G: as VT1 on sheet LoRaBoard_2; Part Number: 2N7002ET1G; Value: 2N7002; Package: SOT-23; Temperature Range: -55…+150°C
X8 X9 = PLD-12: as X1 on sheet LoRaBoard_1; Published: 07.03.2013; Publisher: Andrew Danich; Type: Вилка

## Nets that join several sheets
5V0: LoRaBoard_1 (17 pins), LoRaBoard_2 (8 pins)
GND: LoRaBoard_1 (35 pins), LoRaBoard_2 (36 pins), LoRaBoard_3 (42 pins)
BUSY_3: LoRaBoard_1 (U1.18 X2.2), LoRaBoard_2 (R34.2 X6.2)
BUSY_4: LoRaBoard_1 (U1.35 X3.2), LoRaBoard_2 (R27.2 X7.2)
~{CS_3}: LoRaBoard_1 (D1.13 X2.10), LoRaBoard_2 (R25.2 X6.10)
~{CS_4}: LoRaBoard_1 (D1.10 X3.10), LoRaBoard_2 (R29.1 X7.10)
DIO1_3: LoRaBoard_1 (U1.13 X2.5), LoRaBoard_2 (R37.2 X6.5)
DIO1_4: LoRaBoard_1 (U1.29 X3.5), LoRaBoard_2 (R24.2 X7.5)
DIO2_3: LoRaBoard_1 (U1.15 X2.4), LoRaBoard_2 (R47.1 X6.4)
DIO2_4: LoRaBoard_1 (U1.31 X3.4), LoRaBoard_2 (R44.1 X7.4)
DIO3_4: LoRaBoard_1 (U1.33 X3.3), LoRaBoard_2 (R20.2 X7.3)
EN_TX_3: LoRaBoard_1 (U1.22 X2.1), LoRaBoard_2 (R43.1 R45.1 R46.2 X6.1)
EN_TX_4: LoRaBoard_1 (U1.37 X3.1), LoRaBoard_2 (R38.1 R41.1 R42.2 X7.1)
MISO: LoRaBoard_1 (7 pins), LoRaBoard_2 (R21.1 R32.2 X6.9 X7.9)
MOSI: LoRaBoard_1 (7 pins), LoRaBoard_2 (R23.1 R31.2 X6.8 X7.8)
~{NRST_3}: LoRaBoard_1 (D1.14 X2.6), LoRaBoard_2 (R33.2 X6.6)
~{NRST_4}: LoRaBoard_1 (D1.9 X3.6), LoRaBoard_2 (R30.2 X7.6)
SCLK: LoRaBoard_1 (7 pins), LoRaBoard_2 (R26.1 R28.2 X6.7 X7.7)